# EAGLE design imu_middle (EAGLE 9.4.2)
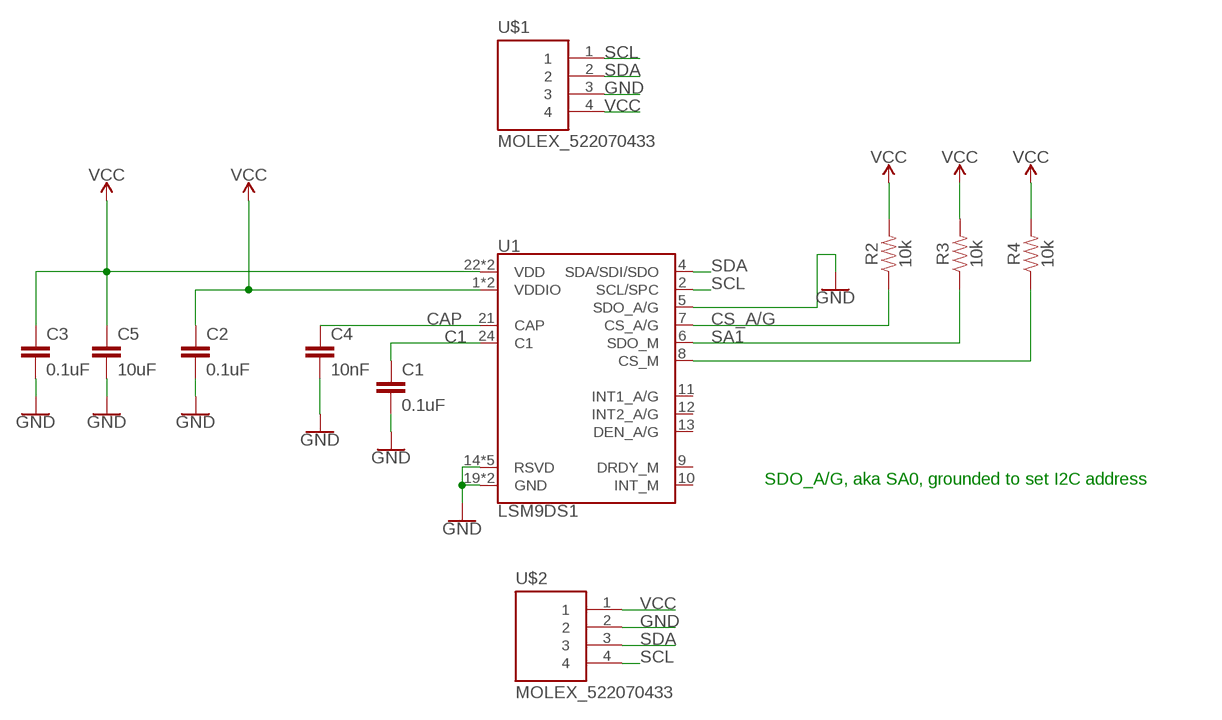
[diagram p0: schematic, sheet 1]

## Parts
C1  0.1uF  0.1UF-0603-25V-(+80/-20%)  [0603]
C2  0.1uF  0.1UF-0603-25V-(+80/-20%)  [0603]
C3  0.1uF  0.1UF-0603-25V-(+80/-20%)  [0603]
C4  10nF  10NF-0603-50V-10%  [0603]
C5  10uF  10UF-0603-6.3V-20%  [0603]
R2  10k  10KOHM-0603-1/10W-1%  [0603]
R3  10k  10KOHM-0603-1/10W-1%  [0603]
R4  10k  10KOHM-0603-1/10W-1%  [0603]
U1  LSM9DS1  [LGA-24-3.5X3]
U$1  MOLEX_522070433  [MOLEX4_1MM]
U$2  MOLEX_522070433  [MOLEX4_1MM]

## Nets
C1: C1.1 U1.24(C1)
CAP: C4.1 U1.21(CAP)
CS_A/G: R2.1 U1.7(CS_A/G)
CS_M: R4.1 U1.8(CS_M)
GND: C1.2 C2.2 C3.2 C4.2 C5.2 U1.5(SDO_A/G) U1.14(RSVD) U1.15(RSVD) U1.16(RSVD) U1.17(RSVD) U1.18(RSVD) U1.19(GND) U1.20(GND) U$1.3 U$2.2
SA1: R3.1 U1.6(SDO_M)
SCL: U1.2(SCL/SPC) U$1.1 U$2.4
SDA: U1.4(SDA/SDI/SDO) U$1.2 U$2.3
VCC: C2.1 C3.1 C5.1 R2.2 R3.2 R4.2 U1.1(VDDIO) U1.3(VDDIO) U1.22(VDD) U1.23(VDD) U$1.4 U$2.1
Unconnected: U1.9(DRDY_M) U1.10(INT_M) U1.11(INT1_A/G) U1.12(INT2_A/G) U1.13(DEN_A/G)

## Notes on the sheet
- SDO_A/G, aka SA0, grounded to set I2C address

## Library data of the parts
C1-C3 = SparkFun-Capacitors:0.1UF: 0.1µF ceramic capacitors A capacitor is a passive two-terminal electrical component used to store electrical energy temporarily in an electric field.; PROD_ID: CAP-00810
C4 = SparkFun-Capacitors:10NF: 0.01uF/10nF/10,000pF ceramic capacitors A capacitor is a passive two-terminal electrical component used to store electrical energy temporarily in an electric field. CAP-09321; PROD_ID: CAP-00867
C5 = SparkFun-Capacitors:10UF: 10.0µF ceramic capacitors A capacitor is a passive two-terminal electrical component used to store electrical energy temporarily in an electric field.; PROD_ID: CAP-11015
R2-R4 = SparkFun-Resistors:10KOHM: 10kΩ resistor A resistor is a passive two-terminal electrical component that implements electrical resistance as a circuit element. Resistors act to reduce current flow, and, at the same time, act to lower voltage levels within circuits. - Wikipedia; PROD_ID: RES-00824
U1 = SparkFun-Sensors:LSM9DS1: ST Microelectronics LSM9DS1 9DOF IMU - Accelerometer, Gyroscope & Magnetometer The LSM9DS1 is a versatile, motion-sensing system-in-a-chip. It houses a 3-axis accelerometer, 3-axis gyroscope, and 3-axis magnetometer – nine degrees of freedom (9DOF) in a single IC! The LSM9DS1 is equipped with a digital interface, but even that is flexible: it supports both I2C and SPI, so you’ll be hard-pressed to find a microcontroller it doesn’t work with. Datasheet <https://cdn.sparkfun.com/assets/learn_tutorials/3/7/3/LSM9DS1_Datasheet.pdf> SparkFun Products SparkFun 9 Degrees of Freedom IMU Breakout - LSM9DS1 <https://www.sparkfun.com/products/13284> (SEN-13284) SparkFun Photon IMU Shield <https://www.sparkfun.com/products/13629> (DEV-13629); PROD_ID: IC-12536
U$1 U$2 = custom:MOLEX_522070433

## Board
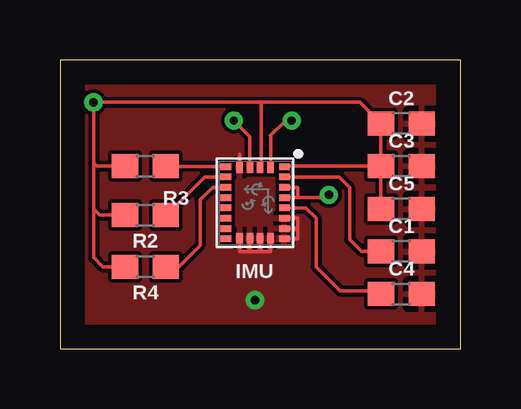
[diagram p1: board, top side]
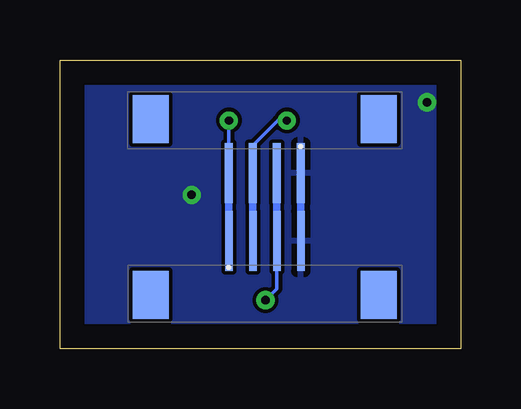
[diagram p2: board, bottom side, seen from below]

Size 16.69 x 12.06 mm. Coordinates in mm from the lower left corner, seen from the top.
Outline: 0,0 16.69,0 16.69,12.06 0,12.06 0,0
Copper layers (1*16): Top 0.035mm / dielectric 1.5mm / Bottom 0.035mm
Design rules "default": minimum track width 6mil, minimum drill 0.35mm, track to track 6mil, track to pad 6mil, pad to pad 6mil, via to via 6mil, smd to smd 6mil, copper to edge 40mil, drill to drill 6mil, minimum pad ring 10mil, minimum via ring 8mil, stop-mask expansion 4mil, vias tented up to drill 0mil, thermal gap 10mil

### Footprints (pad centres in the part's own frame; a part is rotated, then mirrored left to right if it is on the bottom)
0603 = smd 1.1 x 1: 1 -0.85,0; 2 0.85,0
LGA-24-3.5X3 = smd 0.27 x 0.45: 1 -1.505,1.225; 6 -1.505,-1.225; 7 -1.075,-1.225; 8 -0.645,-1.225; 9 -0.215,-1.225; 10 0.215,-1.225; 11 0.645,-1.225; 12 1.075,-1.225; 13 1.505,-1.225; 18 1.505,1.225; 19 1.075,1.225; 20 0.645,1.225; 21 0.215,1.225; 22 -0.215,1.225; 23 -0.645,1.225; 24 -1.075,1.225 | smd 0.45 x 0.27: 2 -1.475,0.645; 3 -1.475,0.215; 4 -1.475,-0.215; 5 -1.475,-0.645; 14 1.475,-0.645; 15 1.475,-0.215; 16 1.475,0.215; 17 1.475,0.645
MOLEX4_1MM = smd 0.32 x 2.5: 1 0,1.2; 2 1,1.2; 3 2,1.2; 4 3,1.2 | smd 1.5 x 2: P$5 6.25,-1.05; P$6 -3.25,-1.05

### Placement (x,y rotation side)
C1  14.22,4.06 0 top
C2  14.22,9.4 0 top
C3  14.22,7.62 0 top
C4  14.22,2.29 0 top
C5  14.22,5.84 0 top
R2  3.56,5.59 180 top
R3  3.56,7.62 180 top
R4  3.56,3.43 180 top
U1  8.13,6.1 270 top
U$1  9.65,3.3 0 bottom
U$2  6.65,8.53 180 bottom

### Tracks (layer width: path | path; a pad name or v marks a point on that pad's centre or on a via)
C1
  Top 0.152: U1.24 11.62,7.17 12.07,6.73 12.07,4.57 12.57,4.06 C1.1
CAP
  Top 0.152: U1.21 10.25,5.88 10.67,5.46 10.67,3.43 11.68,2.41 13.25,2.41 C4.1
CS_A/G
  Top 0.152: U1.7 6.03,7.17 4.45,5.59 R2.1
CS_M
  Top 0.152: U1.8 6.36,6.74 5.84,6.22 5.84,4.32 4.95,3.43 R4.1
GND  (via drill 0.35)
  Top 0.152: 7.91,4.06 7.48,4.06 U1.14 | U1.15 7.91,4.06 | U1.16 8.34,4.06 | 8.34,4.06 8.77,4.06 U1.17 | U1.18 9.91,4.59 9.91,5.02 | 9.91,5.02 U1.19 | U1.5 7.48,8.14 | 7.91,4.06 8.34,4.06 | U1.20 9.37,5.46 9.91,5.46 9.91,5.02
  Bottom 0.152: U$1.3 7.65,2.51 v8.13,2.03
  Bottom 0.305: U$2.2 U$1.3
  pour Top: 0.51,11.43 16.26,11.43 16.26,0.64 0.51,0.64
SA1
  Top 0.152: U1.6 4.43,7.6 R3.1
SCL  (via drill 0.35)
  Top 0.152: U1.2 8.77,8.88 8.76,8.89 9.4,9.53 v9.65,9.53
  Bottom 0.152: v9.65,9.53 v9.66,9.52 9.66,8.89 U$2.4
  Bottom 0.305: U$1.1 U$2.4
SDA  (via drill 0.35)
  Top 0.152: U1.4 7.91,8.85 v7.24,9.53
  Bottom 0.152: v7.24,9.53 7.62,9.53 8.66,8.49 U$2.3
  Bottom 0.305: U$2.3 U$1.2
VCC  (via drill 0.35)
  Top 0.152: 1.4,7.75 v1.4,10.29 8.38,10.29 | 1.4,7.75 1.52,7.62 R3.2 | 1.4,7.75 1.4,5.84 | 1.4,5.84 1.65,5.59 R2.2 | 1.4,5.84 1.4,3.81 1.78,3.43 R4.2 | 8.38,10.29 12.48,10.29 C2.1 C3.1 | C3.1 C5.1 | U1.22 9.91,6.31 | 9.91,6.31 9.91,6.73 9.9,6.74 U1.23 | U1.1 9.37,7.62 C3.1 | v11.2,6.43 11.09,6.31 9.91,6.31 | U1.3 8.38,7.61 8.38,10.29
  Bottom 0.305: U$2.1 U$1.4
  pour Bottom: 0.51,11.43 16.26,11.43 16.26,0.64 0.64,0.64 0.51,0.76

### Text on the board
tPlace: IMU